# EAGLE design ATmega328p microcontroller (EAGLE 9.6.2)
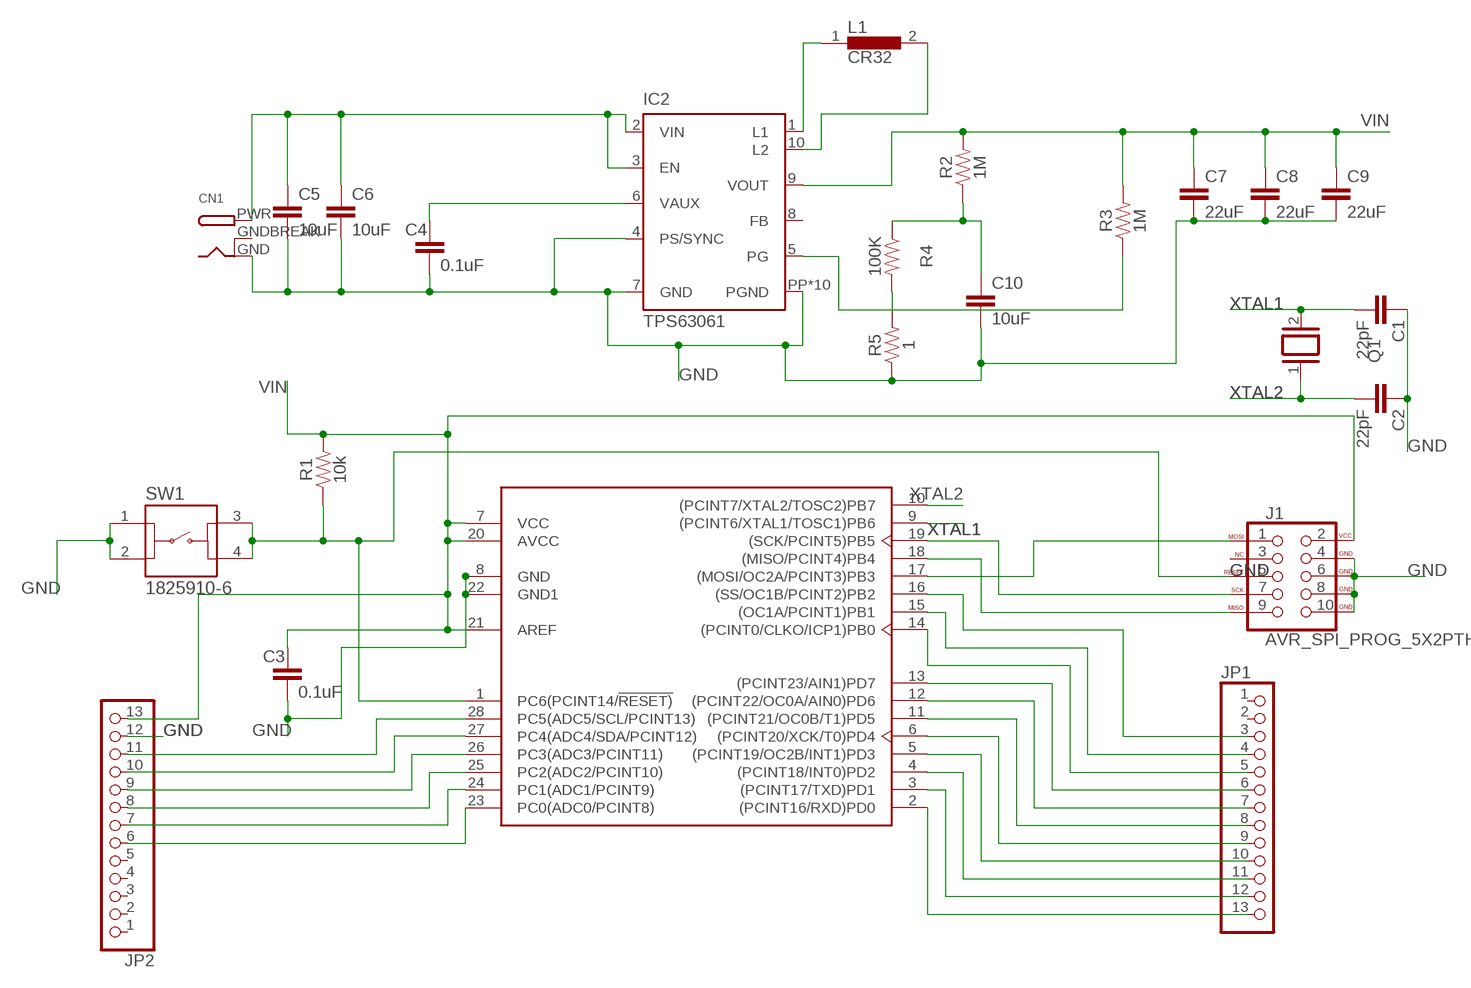
[diagram p0: schematic, sheet 1]

## Parts
C1  22pF  22PF-0603-50V-5%  [0603]
C2  22pF  22PF-0603-50V-5%  [0603]
C3  0.1uF  0.1UF-0402-16V-10%  [0402]
C4  0.1uF  0.1UF-0402-16V-10%  [0402]
C5  10uF  10UF-0603-6.3V-20%  [0603]
C6  10uF  10UF-0603-6.3V-20%  [0603]
C7  22uF  22UF-0805-6.3V-20%  [0805]
C8  22uF  22UF-0805-6.3V-20%  [0805]
C9  22uF  22UF-0805-6.3V-20%  [0805]
C10  10uF  10UF-0603-6.3V-20%  [0603]
CN1  DCBARRELPTH  [DCJACK_2MM_PTH]
IC2  TPS63061  [DSC-S-PWSON-N10]
J1  AVR_SPI_PROG_5X2PTH  [2X5]
JP1  PINHD-1X13  [1X13]
JP2  PINHD-1X13  [1X13]
L1  CR32  [CR32]
Q1  XTAL/S  [QS]
R1  10k  10KOHM-0603-1/10W-1%  [0603]
R2  1M  1MOHM-0603-1/4W-5%  [0603]
R3  1M  1MOHM-0603-1/4W-5%  [0603]
R4  100K  100KOHM-0402-1/16W-1%  [0402]
R5  1  1OHM-0603-1/10W-1%  [0603]
SW1  1825910-6  [1825910-6]
U1  ATMEGA328P-PU  [DIP-28]

## Nets
GND: C1.1 C2.1 C3.2 C4.2 C5.2 C6.2 C7.2 C8.2 C9.2 C10.2 CN1.GND IC2.4(PS/SYNC) IC2.7(GND) IC2.PP(PGND) IC2.PP@1(PGND) IC2.PP@2(PGND) IC2.PP@3(PGND) IC2.PP@4(PGND) IC2.PP@5(PGND) IC2.PP@7(PGND) IC2.PP@8(PGND) IC2.PP@9(PGND) IC2.PP@10(PGND) J1.4(GND) J1.6(GND) J1.8(GND) J1.10(GND) JP2.12 R5.1 SW1.1 SW1.2 U1.8(GND) U1.22(GND1)
N$1: JP2.11 U1.28(PC5(ADC5/SCL/PCINT13))
N$2: J1.7(SCK) U1.19((SCK/PCINT5)PB5)
N$3: J1.9(MISO) U1.18((MISO/PCINT4)PB4)
N$4: J1.1(MOSI) U1.17((MOSI/OC2A/PCINT3)PB3)
N$5: J1.5(RESET) R1.1 SW1.3 SW1.4 U1.1(PC6(PCINT14/!RESET))
N$6: JP1.9 U1.6((PCINT20/XCK/T0)PD4)
N$7: JP1.8 U1.11((PCINT21/OC0B/T1)PD5)
N$8: JP1.7 U1.12((PCINT22/OC0A/AIN0)PD6)
N$9: JP1.13 U1.2((PCINT16/RXD)PD0)
N$10: JP1.12 U1.3((PCINT17/TXD)PD1)
N$11: JP1.11 U1.4((PCINT18/INT0)PD2)
N$12: JP1.10 U1.5((PCINT19/OC2B/INT1)PD3)
N$13: JP1.6 U1.13((PCINT23/AIN1)PD7)
N$14: JP1.5 U1.14((PCINT0/CLKO/ICP1)PB0)
N$15: JP1.4 U1.15((OC1A/PCINT1)PB1)
N$16: JP1.3 U1.16((SS/OC1B/PCINT2)PB2)
N$17: JP2.10 U1.27(PC4(ADC4/SDA/PCINT12))
N$18: JP2.9 U1.26(PC3(ADC3/PCINT11))
N$19: JP2.8 U1.25(PC2(ADC2/PCINT10))
N$20: JP2.7 U1.24(PC1(ADC1/PCINT9))
N$21: JP2.6 U1.23(PC0(ADC0/PCINT8))
N$22: C5.1 C6.1 CN1.PWR IC2.2(VIN) IC2.3(EN)
N$24: C4.1 IC2.6(VAUX)
N$25: IC2.1(L1) L1.1
N$26: IC2.10(L2) L1.2
N$28: C10.1 R2.1 R4.1
N$29: R4.2 R5.2
N$31: IC2.5(PG) R3.1
VIN: C3.1 C7.1 C8.1 C9.1 IC2.9(VOUT) J1.2(VCC) JP2.13 R1.2 R2.2 R3.2 U1.7(VCC) U1.20(AVCC) U1.21(AREF)
XTAL1: C1.2 Q1.2 U1.9((PCINT6/XTAL1/TOSC1)PB6)
XTAL2: C2.2 Q1.1 U1.10((PCINT7/XTAL2/TOSC2)PB7)
Unconnected: IC2.8(FB) J1.3(NC) JP1.1 JP1.2 JP2.1 JP2.2 JP2.3 JP2.4 JP2.5

## Power pins joined to a net without a drawn wire
GNDBREAK: CN1.GNDBREAK

## Library data of the parts
C1 C2 = SparkFun-Capacitors:22PF: 22pF ceramic capacitors A capacitor is a passive two-terminal electrical component used to store electrical energy temporarily in an electric field.; PROD_ID: CAP-07876
C3 C4 = SparkFun-Capacitors:0.1UF: 0.1µF ceramic capacitors A capacitor is a passive two-terminal electrical component used to store electrical energy temporarily in an electric field.; PROD_ID: CAP-12416
C5 C6 C10 = SparkFun-Capacitors:10UF: 10.0µF ceramic capacitors A capacitor is a passive two-terminal electrical component used to store electrical energy temporarily in an electric field.; PROD_ID: CAP-11015
C7-C9 = SparkFun-Capacitors:22UF: 22µF ceramic capacitors A capacitor is a passive two-terminal electrical component used to store electrical energy temporarily in an electric field.; PROD_ID: CAP-08402
CN1 = adafruit:DCBARREL: 2.0mm DC Barrel Jack DCJACK_2MM_PTH - Through Hole Jack (4UConnector: 05537)
IC2 = texas:TPS6306*: HIGH INPUT VOLTAGE BUCK-BOOST CONVERTER WITH 2A SWITCH CURRENT Source: http://www.ti.com/lit/ds/symlink/tps63060.pdf
J1 = SparkFun-Connectors:AVR_SPI_PROG_5X2: AVR 10-pin ICSP Header This is the standard AVR In Circuit Serial Programming header. Minimal, but includes pin one indicator. Works with standard Olimex programmers. SparkFun Products: 2x5 AVR ICSP Male Header <https://www.sparkfun.com/products/778> - PTH 2x5 Pin Shrouded Header <https://www.sparkfun.com/products/8506> - PTH2
JP1 JP2 = adafruit:PINHD-1X13: PIN HEADER
L1 = inductors:CR32: POWER INDUCTORS SMD CR Series Source: www.suminda.com .. CR32.pdf; SPICEPREFIX: L
Q1 = special:XTAL/S: CRYSTAL
R1 = SparkFun-Resistors:10KOHM: 10kΩ resistor A resistor is a passive two-terminal electrical component that implements electrical resistance as a circuit element. Resistors act to reduce current flow, and, at the same time, act to lower voltage levels within circuits. - Wikipedia; PROD_ID: RES-00824
R2 R3 = SparkFun-Resistors:1MOHM: 1MΩ resistor A resistor is a passive two-terminal electrical component that implements electrical resistance as a circuit element. Resistors act to reduce current flow, and, at the same time, act to lower voltage levels within circuits. - Wikipedia; PROD_ID: RES-07868
R4 = SparkFun-Resistors:100KOHM: 100kΩ resistor A resistor is a passive two-terminal electrical component that implements electrical resistance as a circuit element. Resistors act to reduce current flow, and, at the same time, act to lower voltage levels within circuits. - Wikipedia; PROD_ID: RES-13495
R5 = SparkFun-Resistors:1OHM: 1Ω resistor A resistor is a passive two-terminal electrical component that implements electrical resistance as a circuit element. Resistors act to reduce current flow, and, at the same time, act to lower voltage levels within circuits. - Wikipedia; PROD_ID: RES-08269
SW1 = Switch:1825910-6: SWITCH TACTILE SPST-NO 0.05A 24V Manufacturer's datasheet <https://www.te.com/commerce/DocumentDelivery/DDEController?Action=srchrtrv&DocNm=1825910&DocType=Customer+Drawing&DocLang=English>; CREATED_BY: PCBLayout.com; DIGIKEY_PART_NUMBER: 450-1650-ND; MANUFACTURER: TE Connectivity ALCOSWITCH Switches; MPN: 1825910-6
U1 = Microcontroller:ATMEGA328P-PU: IC MCU 8BIT 32KB FLASH 28DIP Manufacturer's datasheet <http://ww1.microchip.com/downloads/en/DeviceDoc/ATmega48A-PA-88A-PA-168A-PA-328-P-DS-DS40002061A.pdf>; CREATED_BY: PCBLayout.com; DIGIKEY_PART_NUMBER: ATMEGA328P-PU-ND; MANUFACTURER: Microchip Technology; MPN: ATMEGA328P-PU; PACKAGE: DIP-28

## Board
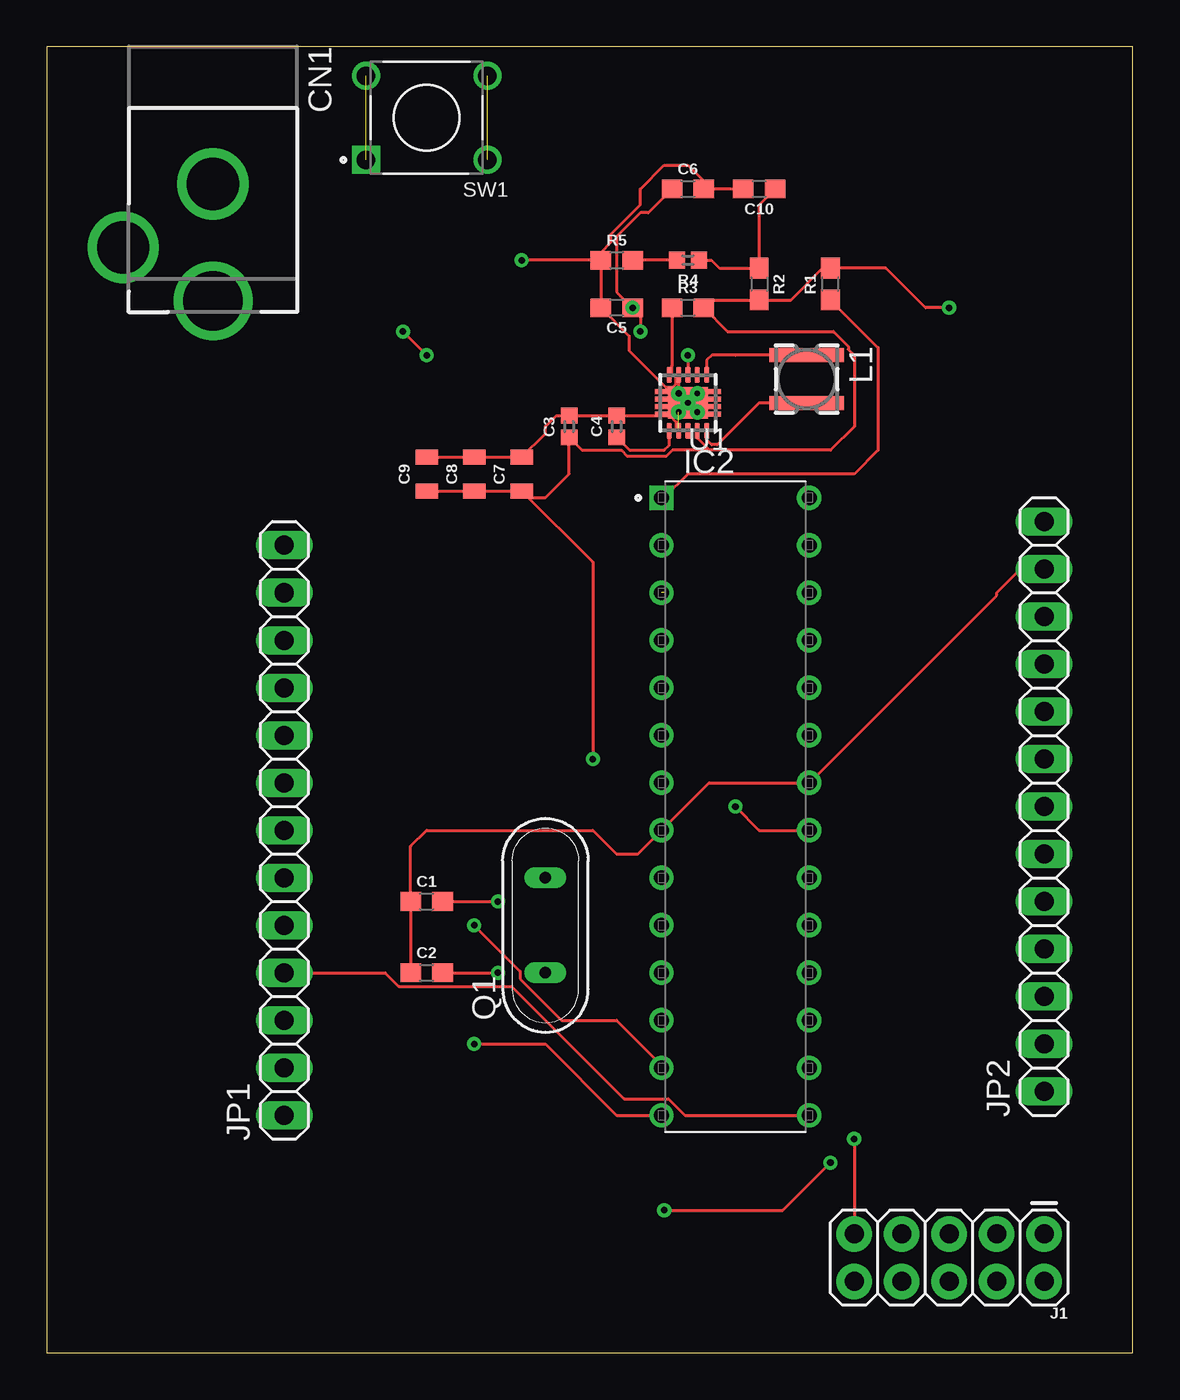
[diagram p1: board, top side]
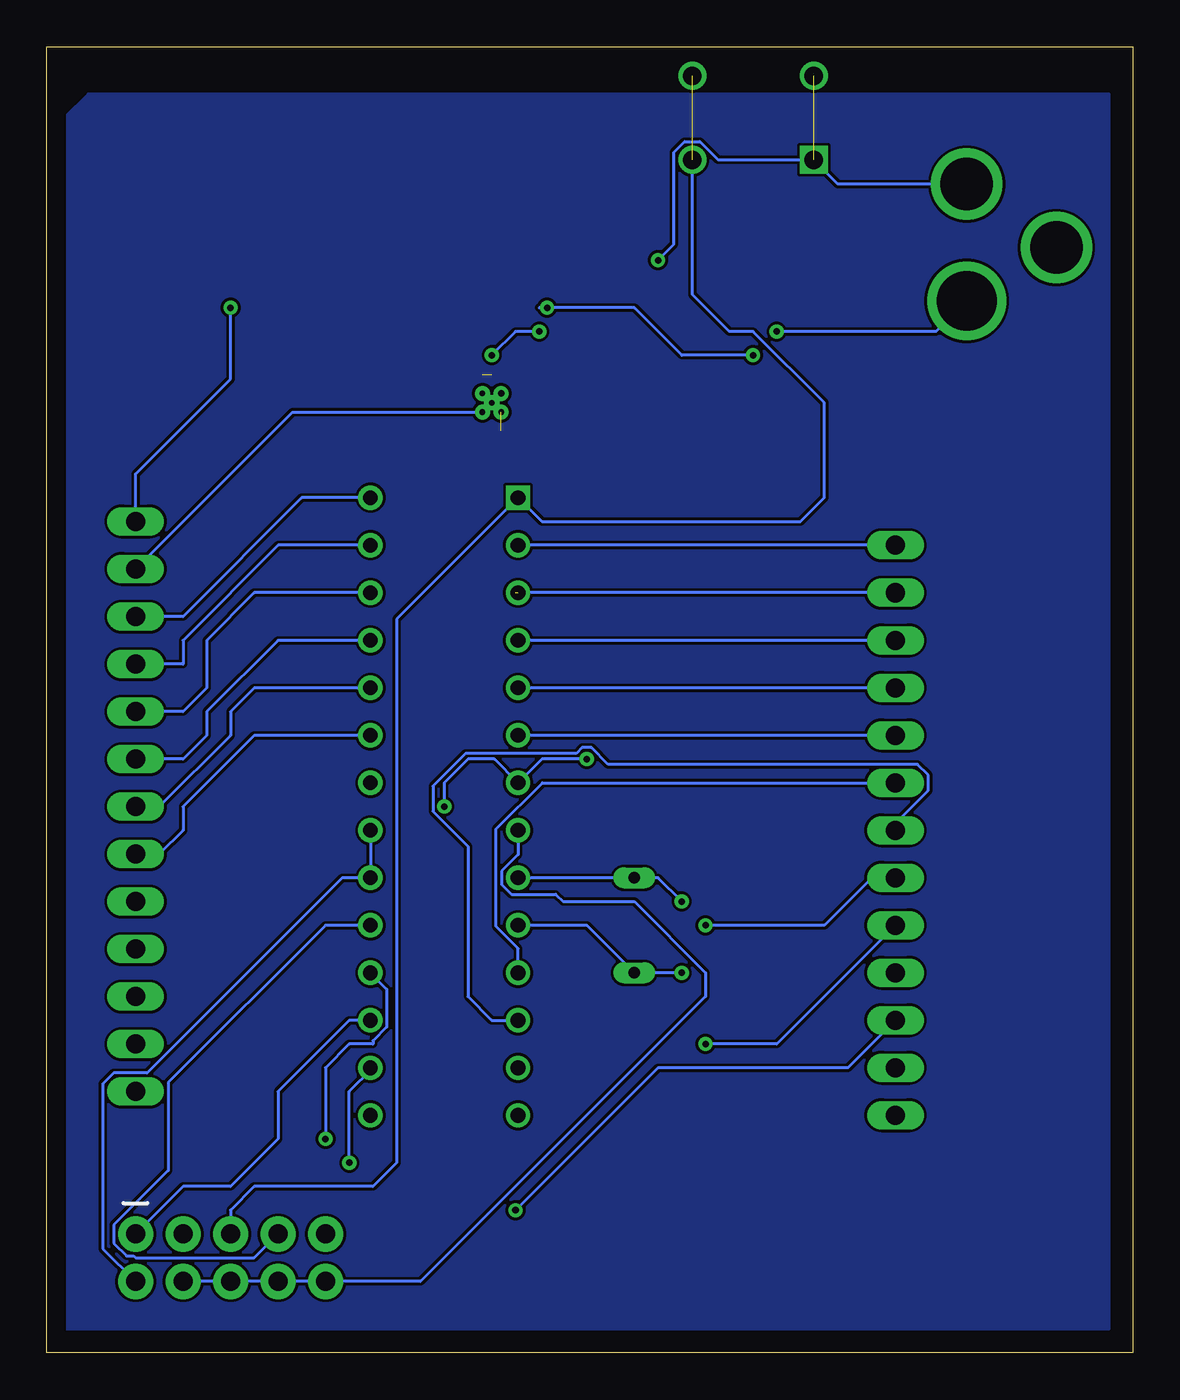
[diagram p2: board, bottom side, seen from below]

Size 58.09 x 69.84 mm. Coordinates in mm from the lower left corner, seen from the top.
Outline: 0,0 58.09,0 58.09,69.84 0,69.84 0,0
Copper layers (1*16): Top 0.035mm / dielectric 1.5mm / Bottom 0.035mm
Design rules "default": minimum track width 6mil, minimum drill 0.35mm, track to track 6mil, track to pad 6mil, pad to pad 6mil, via to via 6mil, smd to smd 6mil, copper to edge 40mil, drill to drill 6mil, minimum pad ring 10mil, minimum via ring 8mil, stop-mask expansion 4mil, vias tented up to drill 0mil, thermal gap 10mil

### Footprints (pad centres in the part's own frame; a part is rotated, then mirrored left to right if it is on the bottom)
0603 = smd 1.1 x 1: 1 -0.85,0; 2 0.85,0
0402 = smd 0.85 x 0.9: 1 -0.58,0; 2 0.58,0
0805 = smd 0.8 x 1.2: 1 -0.9,0; 2 0.9,0
DCJACK_2MM_PTH = drill 2.8: GND 0,7.35; GNDBREAK 4.8,10.75 | drill 3.2: PWR 0,13.6
DSC-S-PWSON-N10 = smd 0.28 x 0.85: 1 -1,-1.488; 2 -0.5,-1.488; 3 0,-1.488; 4 0.5,-1.488; 5 1,-1.488; 6 1,1.5; 7 0.5,1.5; 8 0,1.5; 9 -0.5,1.5; 10 -1,1.5 | smd 2.15 x 1.7: PP 0,0 | smd 3.55 x 0.25: PP@1 0,0.6; PP@2 0,0.2; PP@3 0,-0.2; PP@4 0,-0.6 | drill 0.3 pad 0.4: PP@5 -0.5,0.5; PP@7 0,0; PP@8 0.5,0.5; PP@9 -0.5,-0.5; PP@10 0.5,-0.5
2X5 = drill 1.016 pad 1.88: 1 0,0; 2 0,2.54; 3 2.54,0; 4 2.54,2.54; 5 5.08,0; 6 5.08,2.54; 7 7.62,0; 8 7.62,2.54; 9 10.16,0; 10 10.16,2.54
1X13 = drill 1.016 long: 1 -15.24,0; 2 -12.7,0; 3 -10.16,0; 4 -7.62,0; 5 -5.08,0; 6 -2.54,0; 7 0,0; 8 2.54,0; 9 5.08,0; 10 7.62,0; 11 10.16,0; 12 12.7,0; 13 15.24,0
CR32 = smd 0.75 x 4: 1 -1.275,0; 2 1.275,0
QS = drill 0.61 long: 1 -2.54,0; 2 2.54,0
1825910-6 = drill 0.99 square: 1 3.25,2.25 | drill 0.99: 2 3.25,-2.25; 3 -3.25,2.25; 4 -3.25,-2.25
DIP-28 = drill 0.79 pad 1.19 square: 1 -3.95,16.51 | drill 0.79 pad 1.19: 2 -3.95,13.97; 3 -3.95,11.43; 4 -3.95,8.89; 5 -3.95,6.35; 6 -3.95,3.81; 7 -3.95,1.27; 8 -3.95,-1.27; 9 -3.95,-3.81; 10 -3.95,-6.35; 11 -3.95,-8.89; 12 -3.95,-11.43; 13 -3.95,-13.97; 14 -3.95,-16.51; 15 3.95,-16.51; 16 3.95,-13.97; 17 3.95,-11.43; 18 3.95,-8.89; 19 3.95,-6.35; 20 3.95,-3.81; 21 3.95,-1.27; 22 3.95,1.27; 23 3.95,3.81; 24 3.95,6.35; 25 3.95,8.89; 26 3.95,11.43; 27 3.95,13.97; 28 3.95,16.51

### Placement (x,y rotation side)
C1  20.32,24.13 0 top
C2  20.32,20.32 0 top
C3  27.94,49.53 90 top
C4  30.48,49.53 90 top
C5  30.48,55.88 180 top
C6  34.29,62.23 0 top
C7  25.4,46.99 90 top
C8  22.86,46.99 90 top
C9  20.32,46.99 90 top
C10  38.1,62.23 180 top
CN1  8.89,69.85 180 top
IC2  34.29,50.8 180 top
J1  53.34,6.35 180 top
JP1  12.7,27.94 90 top
JP2  53.34,29.21 90 top
L1  40.64,52.07 270 top
Q1  26.67,22.86 90 top
R1  41.91,57.15 90 top
R2  38.1,57.15 270 top
R3  34.29,55.88 0 top
R4  34.29,58.42 180 top
R5  30.48,58.42 0 top
SW1  20.32,66.04 180 top
U1  36.83,29.21 0 top

### Tracks (layer width: path | path; a pad name or v marks a point on that pad's centre or on a via)
GND  (via drill 0.35)  (2 unrouted)
  Top 0.152: C9.2 C8.2 C7.2 26.67,49.16 26.67,49.53 27.25,50.11 C3.2 C4.2 33.33,50.11 33.66,49.78 33.66,49.43 IC2.7 | C10.2 C6.2 35.14,62.65 34.29,63.5 33.02,63.5 31.75,62.23 31.75,61.39 30.18,59.82 30.18,59.38 29.63,58.84 R5.1 | R5.1 C5.2 31.14,54.37 31.14,53.59 33.1,51.63 33.48,51.63 33.66,51.81 33.66,52.16 IC2.4 IC2.PP@10 | R5.1 v25.4,58.42 | C2.1 C1.1 19.47,27.09 20.32,27.94 29.21,27.94 30.48,26.67 31.61,26.67 U1.8 35.42,30.48 U1.22 50.8,40.5 50.8,40.64 52.07,41.91 JP2.12
  Bottom 0.152: v25.4,58.42 24.55,59.27 24.55,64.19 23.97,64.77 23.16,64.77 22.19,63.79 SW1.1 15.78,62.5 CN1.GND | JP2.12 44.95,50.3 IC2.PP@5 | U1.8 32.88,26.64 33.76,25.76 33.76,25.04 33.24,24.52 30.87,24.52 30.48,24.13 26.67,24.13 22.86,20.32 22.86,19.05 38.1,3.81 J1.10 J1.8 J1.6 J1.4
  other vias: 33.79,51.3 33.79,51.3
N$1
  Bottom 0.152: U1.28 44.45,45.72 50.8,39.37 JP2.11
N$2
  Bottom 0.152: U1.19 43.18,22.86 51.59,14.45 51.59,9.75 54.51,6.83 54.51,5.87 53.82,5.18 53.44,5.18 53.34,5.08 46.99,5.08 J1.7
N$3  (via drill 0.35)
  Top 0.152: v43.18,11.43 J1.9
  Bottom 0.152: U1.18 39.9,19.44 39.9,17.42 40.64,16.68 40.64,16.51 41.91,16.51 43.18,15.24 v43.18,11.43
N$4
  Bottom 0.152: U1.17 41.91,17.78 45.72,13.97 45.72,11.43 48.26,8.89 50.8,8.89 J1.1
N$5  (1 unrouted)
  Top 0.152: R1.1 44.45,53.76 44.45,48.26 43.18,46.99 34.29,46.99 33.02,45.72 U1.1
  Bottom 0.152: SW1.3 23.57,56.59 21.59,54.61 20.32,54.61 16.51,50.8 16.51,45.72 17.78,44.45 31.61,44.45 U1.1 39.37,39.23 39.37,10.16 40.64,8.89 46.99,8.89 48.26,7.62 J1.5
N$6
  Bottom 0.152: JP1.9 U1.6
N$7  (via drill 0.35)
  Bottom 0.152: U1.11 32.88,21.62 34.06,22.8 34.06,28 31.58,30.48 JP1.8
  other vias: 32.88,20.32
N$8
  Bottom 0.152: JP1.7 12.7,28.32 10.95,30.07 10.95,30.89 11.53,31.47 28.07,31.47 28.96,32.36 29.46,32.36 29.76,32.05 35.69,32.05 37.44,30.3 37.44,28.96 35.56,27.08 35.56,19.05 34.29,17.78 U1.12
N$9
  Bottom 0.152: JP1.13 U1.2
N$10  (1 unrouted)
  Bottom 0.152: JP1.12 33.02,40.64
N$11
  Bottom 0.152: JP1.11 U1.4
N$12
  Bottom 0.152: JP1.10 U1.5
N$13  (via drill 0.35)
  Top 0.152: v22.86,22.86 25.32,20.4 25.32,19.99 27.54,17.78 30.48,17.78 32.88,15.38 U1.13
  Bottom 0.152: JP1.6 13.97,25.4 16.51,22.86 v22.86,22.86
N$14  (via drill 0.35)
  Top 0.152: v22.86,16.51 26.67,16.51 30.48,12.7 U1.14
  Bottom 0.152: JP1.5 19.05,16.51 v22.86,16.51
N$15
  Top 0.152: JP1.4 18.1,20.32 18.82,19.59 24.86,19.59 30.87,13.58 33.24,13.58 34.12,12.7 U1.15
N$16  (via drill 0.35)
  Top 0.152: v33.02,7.62 39.37,7.62 v41.91,10.16
  Bottom 0.152: JP1.3 15.24,15.24 25.4,15.24 v33.02,7.62 | v41.91,10.16 41.91,13.97 40.64,15.24 U1.16
N$17
  Bottom 0.152: U1.27 45.72,43.18 50.8,38.1 50.8,36.83 JP2.10
N$18
  Bottom 0.152: U1.26 46.99,40.64 49.53,38.1 49.53,35.56 50.8,34.29 JP2.9
N$19
  Bottom 0.152: U1.25 45.72,38.1 49.53,34.29 49.53,33.02 50.8,31.75 JP2.8
N$20
  Bottom 0.152: U1.24 46.99,35.56 48.26,34.29 48.26,33.02 52.07,29.21 JP2.7
N$21
  Bottom 0.152: U1.23 46.99,33.02 50.8,29.21 50.8,27.94 52.07,26.67 JP2.6
N$22  (via drill 0.35)  (1 unrouted)
  Top 0.152: C6.1 32.17,60.96 31.75,60.96 30.48,59.69 30.48,56.73 C5.1 31.75,55.46 v31.75,54.61 | v19.05,54.61 v20.32,53.34 | v34.29,53.34 IC2.3
  Bottom 0.152: CN1.PWR 10.53,54.61 v19.05,54.61 | v20.32,53.34 24.13,53.34 26.67,55.88 C5.1 31.75,55.88 | v31.75,54.61 33.02,54.61 v34.29,53.34
  other vias: 31.33,55.88
N$23
  pour Bottom: 3.81,67.31 55.88,67.31 57.15,66.04 57.15,1.27 1.27,1.27 1.27,67.31
N$24
  Top 0.152: C4.1 31.17,48.26 33.02,48.26 33.29,48.53 IC2.6
N$25
  Top 0.152: L1.1 36.83,53.35 | 36.83,53.35 36.83,53.34 | 36.83,53.35 35.56,53.35 35.29,53.07 IC2.1
N$26
  Top 0.152: L1.2 38.09,50.8 35.86,48.56 35.56,48.56 35.29,48.84 IC2.10
N$28
  Top 0.152: C10.1 38.1,61.38 R2.1 35.98,58 35.56,58.42 R4.1
N$29
  Top 0.152: R4.2 R5.2
N$31
  Top 0.152: R3.1 33.44,52.79 33.42,52.77 33.42,52.42 IC2.5
VIN  (via drill 0.35)
  Top 0.152: C9.1 C8.1 C7.1 | C7.1 25.77,45.72 26.67,45.72 27.94,46.99 C3.1 28.63,48.26 30.74,48.26 31.04,47.95 33.15,47.95 33.45,48.26 35.43,48.26 | 35.43,48.26 41.91,48.26 43.18,49.53 43.18,53.34 42.87,53.65 42.87,53.82 42.07,54.61 36.41,54.61 R3.2 35.56,56.3 R2.2 39.79,56.3 41.49,58 R1.2 44.87,58 46.99,55.88 v48.26,55.88 | IC2.9 34.79,48.9 35.43,48.26 | C7.1 29.21,42.28 v29.21,31.75 | v36.83,29.21 38.1,27.94 U1.21
  Bottom 0.152: JP2.13 53.34,46.99 48.26,52.07 v48.26,55.88 | v29.21,31.75 31.61,31.75 U1.7 34.15,31.75 35.56,31.75 36.83,30.48 v36.83,29.21 | J1.2 55.09,5.56 55.09,14.38 54.51,14.96 52.73,14.96 42.29,25.4 U1.20 U1.21
XTAL1  (via drill 0.35)
  Top 0.152: C1.2 v24.13,24.13
  Bottom 0.152: v24.13,24.13 25.4,25.4 Q1.2 U1.9
XTAL2  (via drill 0.35)
  Top 0.152: C2.2 v24.13,20.32
  Bottom 0.152: v24.13,20.32 Q1.1 29.21,22.86 U1.10